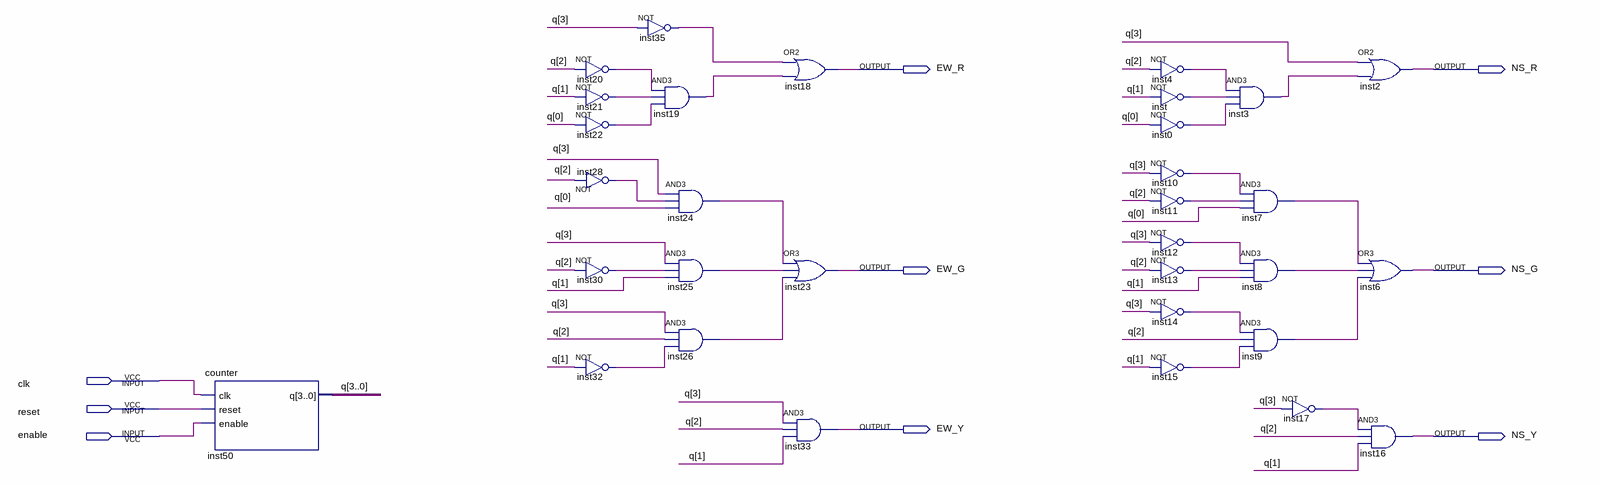
[diagram p0: schematic sheet]
// Quartus schematic traffic.bdf as structural Verilog: 32 symbols, 9 pins
module traffic (
  input  clk,
  input  reset,
  input  enable,
  output EW_R,
  output NS_R,
  output EW_G,
  output NS_G,
  output EW_Y,
  output NS_Y
);

  wire inst0_out, inst3_out, inst4_out, inst7_out, inst8_out, inst9_out, inst10_out, inst11_out, inst12_out,
       inst13_out, inst14_out, inst15_out, inst17_out, inst19_out, inst20_out, inst21_out, inst22_out,
       inst24_out, inst25_out, inst26_out, inst28_out, inst30_out, inst32_out, inst35_out, inst_out;
  wire [3:0] q;

  counter inst50 (.clk(clk), .reset(reset), .enable(enable), .q(q));
  not inst20 (inst20_out, q[2]);
  not inst21 (inst21_out, q[1]);
  not inst22 (inst22_out, q[0]);
  not inst28 (inst28_out, q[2]);
  not inst30 (inst30_out, q[2]);
  not inst32 (inst32_out, q[1]);
  not inst35 (inst35_out, q[3]);
  and inst19 (inst19_out, inst20_out, inst21_out, inst22_out);
  and inst24 (inst24_out, q[3], inst28_out, q[0]);
  and inst25 (inst25_out, q[3], inst30_out, q[1]);
  and inst26 (inst26_out, q[3], q[2], inst32_out);
  or inst18 (EW_R, inst35_out, inst19_out);
  or inst23 (EW_G, inst24_out, inst25_out, inst26_out);
  and inst33 (EW_Y, q[3], q[2], q[1]);
  not inst4 (inst4_out, q[2]);
  not inst (inst_out, q[1]);
  not inst0 (inst0_out, q[0]);
  not inst10 (inst10_out, q[3]);
  not inst11 (inst11_out, q[2]);
  not inst12 (inst12_out, q[3]);
  not inst13 (inst13_out, q[2]);
  not inst14 (inst14_out, q[3]);
  not inst15 (inst15_out, q[1]);
  and inst3 (inst3_out, inst4_out, inst_out, inst0_out);
  and inst7 (inst7_out, inst10_out, inst11_out, q[0]);
  and inst8 (inst8_out, inst12_out, inst13_out, q[1]);
  and inst9 (inst9_out, inst14_out, q[2], inst15_out);
  not inst17 (inst17_out, q[3]);
  or inst2 (NS_R, q[3], inst3_out);
  or inst6 (NS_G, inst7_out, inst8_out, inst9_out);
  and inst16 (NS_Y, inst17_out, q[2], q[1]);
endmodule
